# EAGLE board Stimulation_Testbed_Core_V1 (EAGLE 7.5.0)
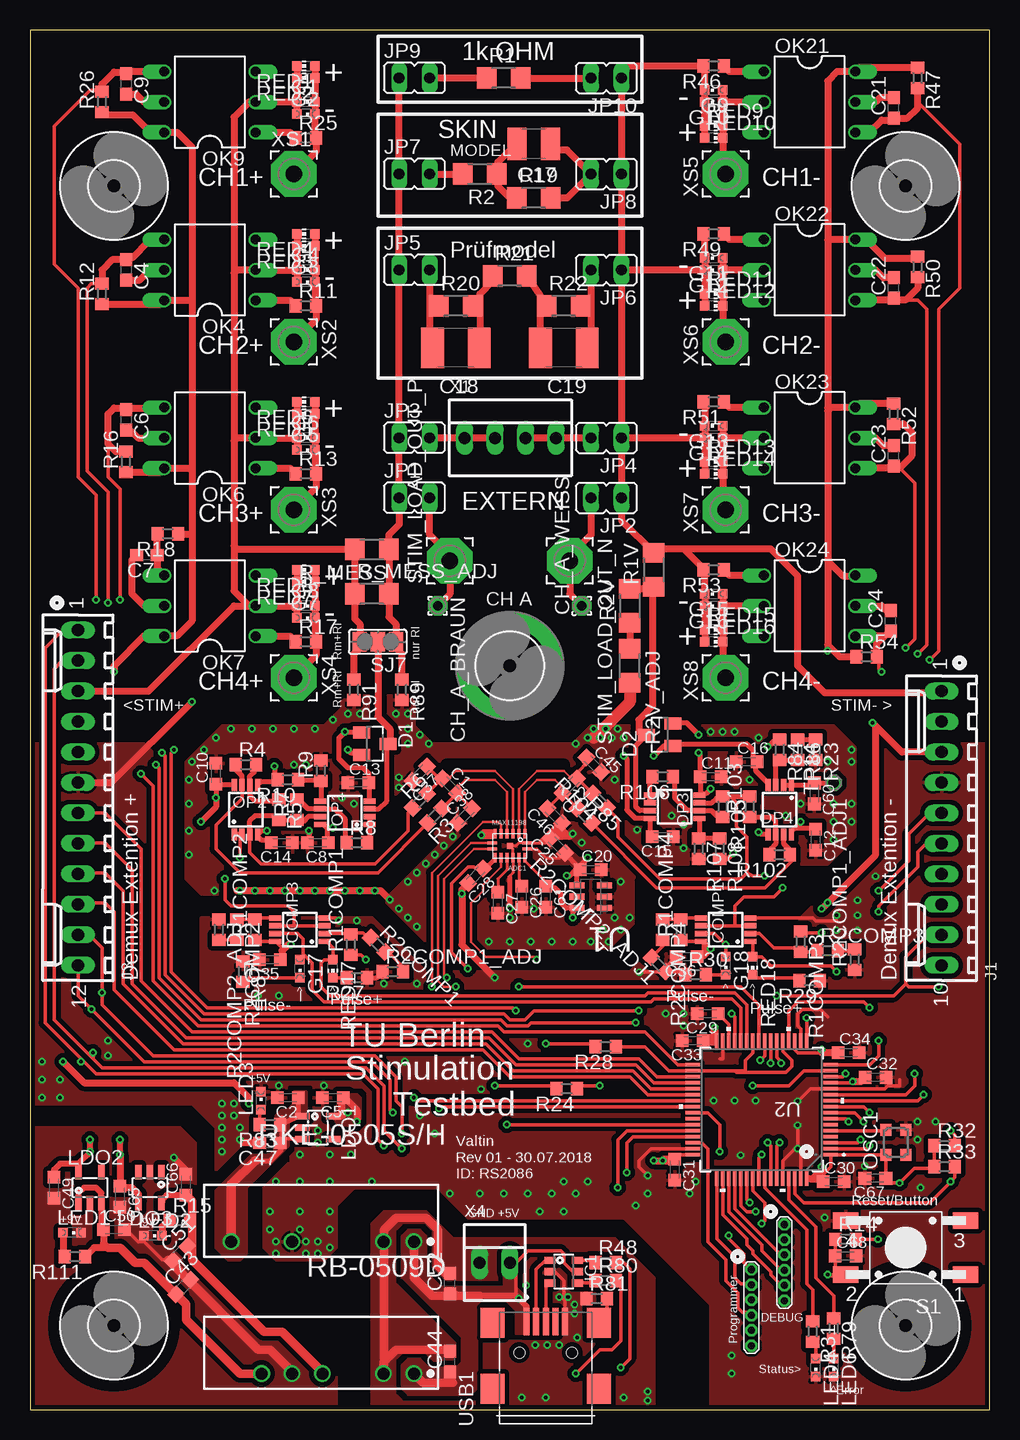
[diagram p3: board, top side]
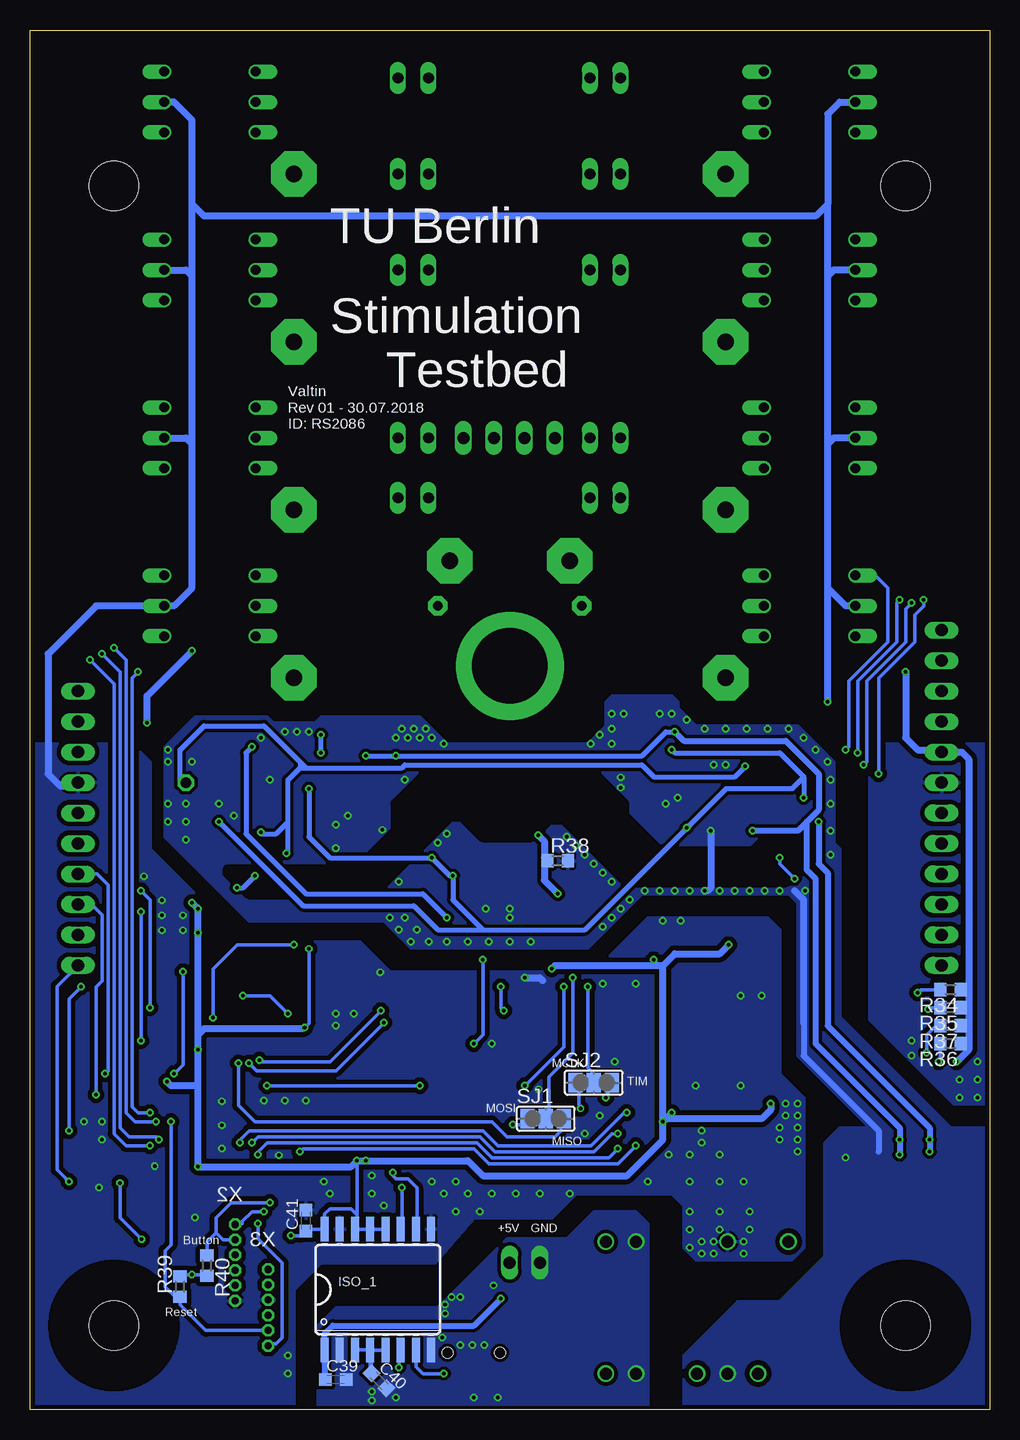
[diagram p4: board, bottom side, seen from below]

Size 80 x 115 mm. Coordinates in mm from the lower left corner, seen from the top.
Outline: 80,0 80,115 0,115 0,0 80,0
Copper layers (1*16): Top 0.035mm / dielectric 1.5mm / Bottom 0.035mm
Design rules "PCB-POOL Standard": minimum track width 0.15mm, minimum drill 0.3mm, track to track 0.15mm, track to pad 0.15mm, pad to pad 0.15mm, via to via 0.15mm, smd to smd 0.15mm, copper to edge 0.3mm, drill to drill 0.2mm, minimum pad ring 0.2mm, minimum via ring 0.15mm, stop-mask expansion 0.075mm, vias tented up to drill 0mil, thermal gap 0.2mm
tRestrict: area 34.8,47.8 to 44.5,53.8; area 29.2,46.8 to 31.5,51.4; area 28.9,43 to 33.6,47.5
bRestrict: area 15,43 to 63.5,53

## Footprints (pad centres in the part's own frame; a part is rotated, then mirrored left to right if it is on the bottom)
T1623CN+1 = smd 0.25 x 0.8: 1 -1.25,-1; 2 -0.75,-1; 3 -0.25,-1; 4 0.25,-1; 5 0.75,-1; 6 1.25,-1; 9 1.25,1; 10 0.75,1; 11 0.25,1; 12 -0.25,1; 13 -0.75,1; 14 -1.25,1 | smd 0.8 x 0.25: 7 1.45,-0.25; 8 1.45,0.25; 15 -1.45,0.25; 16 -1.45,-0.25 | smd 0.5 x 0.5: EXP 0,0
C0603K = smd 1.05 x 1.08: 1 -0.875,0; 2 0.875,0
C0603 = smd 1.1 x 1: 1 -0.85,0; 2 0.85,0
C1210 = smd 1.6 x 2.7: 1 -1.4,0; 2 1.4,0
C1812 = smd 1.9 x 3.4: 1 -1.95,0; 2 1.95,0
1,6/0,8 = drill 0.813 pad 1.6 octagon: 1 0,0
MSOP8 = smd 0.45 x 1: 1 -0.975,-2.05; 2 -0.325,-2.05; 3 0.325,-2.05; 4 0.975,-2.05; 5 0.975,2.05; 6 0.325,2.05; 7 -0.325,2.05; 8 -0.975,2.05
SOT23 = smd 1 x 1.4: 1 -0.95,-1.1; 2 0.95,-1.1; 3 0,1.1
MEJ2 = drill 1 pad 1.18: 1 0,0; 2 2.54,0; 5 10.16,0; 7 15.24,0
NMH = drill 1 pad 1.18: 1 0,0; 2 2.54,0; 4 7.62,0; 5 10.16,0; 6 12.7,0
CHIPLED_0603 = smd 0.8 x 0.8: A 0,-0.75; C 0,0.75
5,5-PAD = drill 6.3 pad 9: B6,3 0,0
SOT-23-6 = smd 0.6 x 0.9: 1 -0.95,-1.15; 2 0,-1.15; 3 0.95,-1.15; 4 0.95,1.15; 5 0,1.15; 6 -0.95,1.15
SOIC16WIDE = smd 0.66 x 2.032: 1 -4.445,-5.029; 2 -3.175,-5.029; 3 -1.905,-5.029; 4 -0.635,-5.029; 5 0.635,-5.029; 6 1.905,-5.029; 7 3.175,-5.029; 8 4.445,-5.029; 9 4.445,5.029; 10 3.175,5.029; 11 1.905,5.029; 12 0.635,5.029; 13 -0.635,5.029; 14 -1.905,5.029; 15 -3.175,5.029; 16 -4.445,5.029
6410-10 = drill 1.016 long: 1 11.43,0; 2 8.89,0; 3 6.35,0; 4 3.81,0; 5 1.27,0; 6 -1.27,0; 7 -3.81,0; 8 -6.35,0; 9 -8.89,0; 10 -11.43,0
6410-12 = drill 1.016 long: 1 13.97,0; 2 11.43,0; 3 8.89,0; 4 6.35,0; 5 3.81,0; 6 1.27,0; 7 -1.27,0; 8 -3.81,0; 9 -6.35,0; 10 -8.89,0; 11 -11.43,0; 12 -13.97,0
JP1 = drill 0.914 long: 1 0,-1.27; 2 0,1.27
SOT-23-5 = smd 0.55 x 1.2: 1 -0.95,-1.3; 2 0,-1.3; 3 0.95,-1.3; 4 0.95,1.3; 5 -0.95,1.3
DIL06 = drill 0.813 offset: 1 -2.54,-3.81; 2 0,-3.81; 3 2.54,-3.81; 4 2.54,3.81; 5 0,3.81; 6 -2.54,3.81
OSC_2.5X2 = smd 1 x 0.9: 1 -1.05,-0.825; 2 1.05,-0.825; 3 1.05,0.825; 4 -1.05,0.825
R1206 = smd 1.6 x 1.803: 1 -1.422,0; 2 1.422,0
R0603 = smd 1 x 1.1: 1 -0.85,0; 2 0.85,0
CHIP-LED0603 = smd 0.8 x 0.8: A 0,-0.75; C 0,0.75
TAST_SMD = smd 2.1 x 1.4: 1 -5,2.25; 2 5,2.25; 3 -5,-2.25; 4 5,-2.25
SJ_2 = smd 1.168 x 1.6: 1 -1.524,0; 2 0,0; 3 1.524,0
3,81/1,4 = drill 1.397 pad 3.81 octagon: 1 0,0
TP1-09 = drill 0.9 pad 1.4 octagon: TP 0,0
SOT95P280X100-6N = smd 1.219 x 0.508: 1 -1.143,0.94; 2 -1.143,0; 3 -1.143,-0.94; 4 1.143,-0.94; 5 1.143,0; 6 1.143,0.94
LQFP64-10X10MM = smd 1.194 x 0.305: 1 -5.75,3.75; 2 -5.75,3.25; 3 -5.75,2.75; 4 -5.75,2.25; 5 -5.75,1.75; 6 -5.75,1.25; 7 -5.75,0.75; 8 -5.75,0.25; 9 -5.75,-0.25; 10 -5.75,-0.75; 11 -5.75,-1.25; 12 -5.75,-1.75; 13 -5.75,-2.25; 14 -5.75,-2.75; 15 -5.75,-3.25; 16 -5.75,-3.75; 33 5.75,-3.75; 34 5.75,-3.25; 35 5.75,-2.75; 36 5.75,-2.25; 37 5.75,-1.75; 38 5.75,-1.25; 39 5.75,-0.75; 40 5.75,-0.25; 41 5.75,0.25; 42 5.75,0.75; 43 5.75,1.25; 44 5.75,1.75; 45 5.75,2.25; 46 5.75,2.75; 47 5.75,3.25; 48 5.75,3.75 | smd 0.305 x 1.194: 17 -3.75,-5.75; 18 -3.25,-5.75; 19 -2.75,-5.75; 20 -2.25,-5.75; 21 -1.75,-5.75; 22 -1.25,-5.75; 23 -0.75,-5.75; 24 -0.25,-5.75; 25 0.25,-5.75; 26 0.75,-5.75; 27 1.25,-5.75; 28 1.75,-5.75; 29 2.25,-5.75; 30 2.75,-5.75; 31 3.25,-5.75; 32 3.75,-5.75; 49 3.75,5.75; 50 3.25,5.75; 51 2.75,5.75; 52 2.25,5.75; 53 1.75,5.75; 54 1.25,5.75; 55 0.75,5.75; 56 0.25,5.75; 57 -0.25,5.75; 58 -0.75,5.75; 59 -1.25,5.75; 60 -1.75,5.75; 61 -2.25,5.75; 62 -2.75,5.75; 63 -3.25,5.75; 64 -3.75,5.75
4,1 = hole 4.1: 0,0
TE_1-1734035-1 = smd 0.5 x 2.3: 1 -1.6,7.85; 2 -0.8,7.85; 3 0,7.85; 4 0.8,7.85; 5 1.6,7.85 | smd 2 x 2.5: 7 4.45,7.75; 8 -4.45,7.75; 9 -4.45,2.25; 10 4.45,2.25 | hole 0.9: -2.2,5.25; 2.2,5.25
22-23-2041 = drill 1 long: 1 -3.81,0; 2 -1.27,0; 3 1.27,0; 4 3.81,0
1.27_1X06_S = drill 0.6 pad 0.813 octagon: P1 0.635,3.175; P2 0.635,1.905; P3 0.635,0.635; P4 0.635,-0.635; P5 0.635,-1.905; P6 0.635,-3.175
22-23-2021 = drill 1 long: 1 -1.27,0; 2 1.27,0

## Placement (x,y rotation side)
ADC1  MAX11198  [T1623CN+1]  40,47 180 top
C1  1nF/25V/C0G/5%  [C0603K]  35,52 315 top
C2  1uF/25V/X7R/10%  [C0603K]  21.5,26 180 top
C4  1nF/25V/X7R/10%  [C0603]  8,95 270 top
C5  1uF/25V/X7R/10%  [C0603K]  25.25,26 180 top
C6  1nF/25V/X7R/10%  [C0603]  8,82.5 270 top
C7  1nF/25V/X7R/10%  [C0603]  9.75,71.25 180 top
C8  100nF/25V/X7R/10%  [C0603K]  24,47.25 180 top
C9  1nF/25V/X7R/10%  [C0603]  8,110.5 270 top
C10  100nF/25V/X7R/10%  [C0603K]  15.5,53 90 top
C11  100nF/25V/X7R/10%  [C0603K]  56.75,52.75 0 top
C12  100nF/25V/X7R/10%  [C0603K]  65.5,47.5 270 top
C13  100nF/25V/X7R/10%  [C0603K]  27.38,52.25 0 top
C14  100nF/25V/X7R/10%  [C0603K]  21,47.25 180 top
C15  100nF/25V/X7R/10%  [C0603K]  52.75,47.75 180 top
C16  100nF/25V/X7R/10%  [C0603K]  59.75,54 0 top
C17  220nF/250V/X7R/10%  [C1210]  42,105.5 180 top
C18  330nF/250V/X7R/10%  [C1812]  35.5,88.5 180 top
C19  330nF/250V/X7R/10%  [C1812]  44.5,88.5 180 top
C20  100nF/25V/X7R/10%  [C0603K]  46.75,45 0 top
C21  1nF/25V/X7R/10%  [C0603]  72,108.5 90 top
C22  1nF/25V/X7R/10%  [C0603]  72,93.5 90 top
C23  1nF/25V/X7R/10%  [C0603]  72,79.5 90 top
C24  1nF/25V/X7R/10%  [C0603]  71.75,65.75 90 top
C25  10uF/25V/X7R/10%  [C0603K]  44,47 135 top
C26  10uF/25V/X7R/10%  [C0603K]  41,42.75 270 top
C27  10uF/25V/X7R/10%  [C0603K]  39,42.25 270 top
C28  10uF/25V/X7R/10%  [C0603K]  37.15,44.5 225 top
C29  4.7uF/25V/X7R/10%  [C0603K]  56.5,33 180 top
C30  4.7uF/25V/X7R/10%  [C0603K]  67,19 0 top
C31  4.7uF/25V/X7R/10%  [C0603K]  53.75,20 270 top
C32  4.7uF/25V/X7R/10%  [C0603K]  70.5,27.7 0 top
C33  4.7uF/25V/X7R/10%  [C0603K]  55.25,30.75 180 top
C34  4.7uF/25V/X7R/10%  [C0603K]  68.25,29.75 0 top
C35  100nF/25V/X7R/10%  [C0603K]  20,37.5 180 top
C36  100nF/25V/X7R/10%  [C0603K]  54.75,37.75 180 top
C37  0.1nF/25V/C0G/5%  [C0603K]  32.5,53 225 top
C38  0.1nF/25V/C0G/5%  [C0603K]  36.25,49.5 45 top
C39  100nF/25V/X7R/10%  [C0603K]  54.5,2.5 0 bottom
C40  100nF/25V/X7R/10%  [C0603K]  50.9,2.4 315 bottom
C41  100nF/25V/X7R/10%  [C0603K]  57,15.75 90 bottom
C42  1nF/25V/C0G/5%  [C0603K]  45,52 225 top
C43  4.7u/25V/X7R  [C0603]  12.77,10.2 45 top
C44  4.7u/15V/X7R  [C0603]  35,4 90 top
C45  0.1nF/25V/C0G/5%  [C0603K]  47,53.75 315 top
C46  0.1nF/25V/C0G/5%  [C0603K]  43.75,49.5 135 top
C47  4.7u/25V/X7R  [C0603]  20,22.25 180 top
C49  1uF/25V/X7R/10%  [C0603K]  2,18.5 270 top
C50  1uF/25V/X7R/10%  [C0603K]  7,15 0 top
C51  4.7u/25V/X7R  [C0603]  12.5,13 45 top
C52  4.7u/25V/X7R  [C0603]  35,10.5 90 top
C60  1uF/25V/X7R/10%  [C0603K]  65.39,51.36 270 top
C61  1uF/25V/X7R/10%  [C0603K]  43,42.75 270 top
C65  4.7uF/25V/X7R/10%  [C0603K]  7.5,17.75 270 top
C66  1uF/25V/X7R/10%  [C0603K]  13,18.75 90 top
C67  100nF/25V/X7R/10%  [C0603K]  70.48,19.28 180 top
C68  100nF/25V/X7R/10%  [C0603K]  68,12.8 0 top
CH_A_BRAUN  [1,6/0,8]  34,67 270 top
CH_A_WEISS  [1,6/0,8]  46,67 90 top
COMP1  TS3022IST  [MSOP8]  58,40 90 top
COMP3  TS3022IST  [MSOP8]  22.5,40 90 top
D1  BAS70-04  [SOT23]  28.75,55.5 270 top
D2  BAS70-04  [SOT23]  52.5,56.25 90 top
DC-DC_3V3  RKE-0505S/H  [MEJ2]  32,14 180 top
DC-DC_9V  RB-0509D  [NMH]  32,3 180 top
G1  150060VS75000  [CHIPLED_0603]  23,109 270 top
G2  150060VS75000  [CHIPLED_0603]  23,108 270 top
G3  150060VS75000  [CHIPLED_0603]  23,94 270 top
G4  150060VS75000  [CHIPLED_0603]  23,95 270 top
G5  150060VS75000  [CHIPLED_0603]  23,80 270 top
G6  150060VS75000  [CHIPLED_0603]  23,81 270 top
G7  150060VS75000  [CHIPLED_0603]  23,66 270 top
G8  150060VS75000  [CHIPLED_0603]  23,67 270 top
G9  150060VS75000  [CHIPLED_0603]  57,110 90 top
G10  150060VS75000  [CHIPLED_0603]  57,109 90 top
G11  150060VS75000  [CHIPLED_0603]  57,96 90 top
G12  150060VS75000  [CHIPLED_0603]  57,95 90 top
G13  150060VS75000  [CHIPLED_0603]  57,82 90 top
G14  150060VS75000  [CHIPLED_0603]  57,81 90 top
G15  150060VS75000  [CHIPLED_0603]  57,68 90 top
G16  150060VS75000  [CHIPLED_0603]  57,67 90 top
G17  150060VS75000  [CHIPLED_0603]  22.5,36.75 180 top
G18  150060VS75000  [CHIPLED_0603]  58,37 180 top
H1  BINDER_STIM  [5,5-PAD]  40,62 270 top
IC1  USBLC6-2  [SOT-23-6]  44.5,11.5 270 top
ISO_1  ADUM4160  [SOIC16WIDE]  51,10 0 bottom
J1  22-27-2101-10  [6410-10]  76,48.45 90 top
J3  22-27-2121-12  [6410-12]  4,51 90 top
JP1  [JP1]  32.05,76 270 top
JP2  [JP1]  48.05,76 90 top
JP3  [JP1]  32.05,81 270 top
JP4  [JP1]  48.05,81 90 top
JP5  [JP1]  32.05,95 270 top
JP6  [JP1]  48.05,95 90 top
JP7  [JP1]  32.05,103 270 top
JP8  [JP1]  48.05,103 90 top
JP9  [JP1]  32.05,111 270 top
JP10  [JP1]  48.05,111 90 top
LDO1  LDK220U33R ->3.3V  [SOT-23-5]  24,23.5 270 top
LDO2  LDK220M50R ->5V  [SOT-23-5]  5,18.5 0 top
LDO3  MIC5270-5.0YM5  [SOT-23-5]  10,18.5 180 top
LED1  [CHIPLED_0603]  3.5,14.75 270 top
LED2  [CHIPLED_0603]  10.25,14.5 270 top
LED3  [CHIPLED_0603]  19.25,25.75 0 top
LED4  Red  [CHIPLED_0603]  65.5,3.5 180 top
LED6  Red  [CHIPLED_0603]  67,3.5 180 top
OK4  H11L1M  [DIL06]  15,95 90 top
OK6  H11L1M  [DIL06]  15,81 90 top
OK7  H11L1M  [DIL06]  15,67 90 top
OK9  H11L1M  [DIL06]  15,109 90 top
OK21  H11L1M  [DIL06]  65,109 270 top
OK22  H11L1M  [DIL06]  65,95 270 top
OK23  H11L1M  [DIL06]  65,81 270 top
OK24  H11L1M  [DIL06]  65,67 270 top
OP1  LT1819CMS8#PBF  [MSOP8]  26.25,49.75 90 top
OP2  LT1819CMS8#PBF  [MSOP8]  18,50 0 top
OP3  LT1819CMS8#PBF  [MSOP8]  53.75,50.25 270 top
OP4  LT1819CMS8#PBF  [MSOP8]  62.5,50 180 top
OSC1  DSC6011JI2A-008.0000 / X1G004171001512  [OSC_2.5X2]  72.18,22.27 90 top
R1  1k  [R1206]  39.5,111 0 top
R1COMP1  7k  [R0603]  26.75,38.75 90 top
R1COMP2  7k  [R0603]  18.75,40 90 top
R1COMP3  7k  [R0603]  64.25,39 270 top
R1COMP4  7k  [R0603]  54.25,40 90 top
R1V  1M49  [R1206]  52,70 90 top
R2  470R  [R1206]  37.5,103 180 top
R2COMP1  5k  [R0603]  29,38.75 315 top
R2COMP1_ADJ  [R0603]  30.25,36.5 0 top
R2COMP1_ADJ1  [R0603]  68.75,37.5 90 top
R2COMP2  5k  [R0603]  17.25,40 270 top
R2COMP2_ADJ  1k  [R0603]  15.75,40 270 top
R2COMP2_ADJ1  1k  [R0603]  52.4,37.1 135 top
R2COMP3  5k  [R0603]  66.5,38.25 0 top
R2COMP4  5k  [R0603]  52.75,40 270 top
R2V  10k  [R1206]  50,67 90 top
R2V_ADJ  0  [R1206]  50,62 270 top
R3  11R  [R0603]  33.75,49.5 225 top
R4  1k  [R0603]  18,53.75 0 top
R5  1k  [R0603]  20.75,50 270 top
R6  11R  [R0603]  32.5,50.75 45 top
R7  1k  [R0603]  22.25,50 90 top
R8  1k  [R0603]  27.25,47.25 0 top
R9  1k  [R0603]  24.25,53.25 90 top
R10  1k  [R0603]  21.5,52.5 180 top
R11  51  [R0603]  23,92 0 top
R12  100k  [R0603]  6,93 90 top
R13  51  [R0603]  23,78 0 top
R14  100k/1%  [R0603]  68,14.2 0 top
R15  2k/1%  [R0603]  12.5,15.75 0 top
R16  100k  [R0603]  8,79 90 top
R17  51  [R0603]  23,64 0 top
R18  100k  [R0603]  11.5,73 180 top
R19  2k7  [R1206]  42,101 0 top
R20  1k8  [R1206]  35.5,92 0 top
R21  1k  [R1206]  40,94.5 0 top
R22  1k8  [R1206]  44.5,92 0 top
R23  0R  [R0603]  65.5,55 270 top
R24  0R  [R0603]  44.75,26.75 180 top
R25  51  [R0603]  23,106 0 top
R26  100k  [R0603]  6,109 90 top
R27  1k/1%  [R0603]  27.25,36 180 top
R28  0R  [R0603]  48,30.25 180 top
R29  1k/1%  [R0603]  65,35.75 180 top
R30  1k/1%  [R0603]  55.5,36.25 0 top
R31  2k/1%  [R0603]  65.25,6.5 270 top
R32  4k7/1%  [R0603]  76.25,22 0 top
R33  4k7/1%  [R0603]  76.25,20.25 0 top
R34  4k7/1%  [R0603]  3.25,35 180 bottom
R35  4k7/1%  [R0603]  3.25,33.5 180 bottom
R36  4k7/1%  [R0603]  3.25,30.5 180 bottom
R37  4k7/1%  [R0603]  3.25,32 180 bottom
R38  NA/0R/1%  [R0603]  36,45.75 0 bottom
R39  0/1%  [R0603]  67.5,10.25 90 bottom
R40  0/1%  [R0603]  65.25,12 270 bottom
R46  51  [R0603]  57,112 180 top
R47  100k  [R0603]  74,111 270 top
R48  24/1%  [R0603]  48,12.25 0 top
R49  51  [R0603]  57,98 180 top
R50  100k  [R0603]  74,95.25 270 top
R51  51  [R0603]  57,84 180 top
R52  100k  [R0603]  72,83 270 top
R53  51  [R0603]  57,70 180 top
R54  100k  [R0603]  69.75,62.75 0 top
R79  2k/1%  [R0603]  67,6.75 270 top
R80  24/1%  [R0603]  48,10.75 0 top
R81  10/5%  [R0603]  47.25,9.25 0 top
R83  1k/1%  [R0603]  20,23.75 180 top
R84  100k  [R0603]  62.5,55 270 top
R85  11R  [R0603]  46.25,49.5 315 top
R86  100k  [R0603]  64,55 270 top
R87  1k/1%  [R0603]  17.75,36.5 270 top
R89  0R or NA  [R0603]  31,60 270 top
R91  NA or 0R  [R0603]  27,60 270 top
R102  1k  [R0603]  62.5,46.25 180 top
R103  1k  [R0603]  60,50.25 90 top
R104  11R  [R0603]  47.5,50.75 135 top
R105  1k  [R0603]  57.75,50.25 270 top
R106  1k  [R0603]  52.75,52.75 180 top
R107  1k  [R0603]  55.75,46.75 270 top
R108  1k  [R0603]  57.5,46.75 270 top
R111  2k/1%  [R0603]  3.75,12.75 180 top
R_MESS  6R7  [R1206]  28.5,71.7 180 top
R_MESS_ADJ  [R1206]  28.5,68 0 top
RED1  150060RS75000  [CHIP-LED0603]  23,112 90 top
RED2  150060RS75000  [CHIP-LED0603]  23,111 90 top
RED3  150060RS75000  [CHIP-LED0603]  23,97 90 top
RED4  150060RS75000  [CHIP-LED0603]  23,98 90 top
RED5  150060RS75000  [CHIP-LED0603]  23,83 90 top
RED6  150060RS75000  [CHIP-LED0603]  23,84 90 top
RED7  150060RS75000  [CHIP-LED0603]  23,69 90 top
RED8  150060RS75000  [CHIP-LED0603]  23,70 90 top
RED9  150060RS75000  [CHIP-LED0603]  57,107 270 top
RED10  150060RS75000  [CHIP-LED0603]  57,106 270 top
RED11  150060RS75000  [CHIP-LED0603]  57,93 270 top
RED12  150060RS75000  [CHIP-LED0603]  57,92 270 top
RED13  150060RS75000  [CHIP-LED0603]  57,79 270 top
RED14  150060RS75000  [CHIP-LED0603]  57,78 270 top
RED15  150060RS75000  [CHIP-LED0603]  57,65 270 top
RED16  150060RS75000  [CHIP-LED0603]  57,64 270 top
RED17  150060RS75000  [CHIP-LED0603]  25.25,36.75 180 top
RED18  150060RS75000  [CHIP-LED0603]  60.25,37 180 top
S1  [TAST_SMD]  73,13.5 180 top
SJ1  [SJ_2]  37,24.25 0 bottom
SJ2  [SJ_2]  33,27.25 0 bottom
SJ7  [SJ_2]  29,64 180 top
STIM_LOAD_OUT_N  [3,81/1,4]  45,70.75 270 top
STIM_LOAD_OUT_P  [3,81/1,4]  35,70.75 90 top
TP14  TESTPOINT_TH  [TP1-09]  67,52.25 90 top
U1  LT1790BCS6-2.5#TRMPBF  [SOT95P280X100-6N]  46.75,42.75 180 top
U2  STM32F412R  [LQFP64-10X10MM]  61,25 180 top
U$1  [4,1]  73,7 0 top
U$2  [4,1]  7,7 0 top
U$3  [4,1]  7,102 0 top
U$4  [4,1]  73,102 0 top
USB1  1-1734035-1  [TE_1-1734035-1]  43,-0.5 0 top
X1  22-23-2041  [22-23-2041]  40.05,81 0 top
X2  PINHD-1X66X1.27  [1.27_1X06_S]  62.25,12.25 0 top
X3  PINHD-1X66X1.27  [1.27_1X06_S]  59.5,8.5 0 top
X4  22-23-2021  [22-23-2021]  38.75,12.25 0 top
XS1  WIREPAD3,81/1,4  [3,81/1,4]  22,103 0 top
XS2  WIREPAD3,81/1,4  [3,81/1,4]  22,89 270 top
XS3  WIREPAD3,81/1,4  [3,81/1,4]  22,75 270 top
XS4  WIREPAD3,81/1,4  [3,81/1,4]  22,61 270 top
XS5  WIREPAD3,81/1,4  [3,81/1,4]  58,103 90 top
XS6  WIREPAD3,81/1,4  [3,81/1,4]  58,89 90 top
XS7  WIREPAD3,81/1,4  [3,81/1,4]  58,75 90 top
XS8  WIREPAD3,81/1,4  [3,81/1,4]  58,61 90 top

## Tracks (layer width: path | path; a pad name or v marks a point on that pad's centre or on a via)
2XVREF
  Top 0.4: OP3.2 OP3.1 51.7,52.55 R106.2
2XVREF1
  Top 0.4: OP1.2 OP1.1 28.3,47.45 R8.2
+3V3  (via drill 0.3)
  Top 0.2: ADC1.9 38.75,45.75 38.25,45.25 38,45.25 37.75,45.25 C28.1 37.76,45.13
  Top 0.3: R1COMP2.1 18.88,39.02 COMP3.8 20.48,39.02 21,38.5 21,38.25 | 21,37.62 C35.1 | R1COMP4.1 54.38,39.02 COMP1.8 56.23,39.02 | 56.23,39.02 56.75,38.5 v56.75,38.4 | v36.5,36.75 35.12,38.12 35.12,43.88 36.5,45.25 37,45.25 37.12,45.13 37.76,45.13 | 38,45.25 38.62,45.88 | U2.48 54.12,21.25 C31.1 | 65,19.25 65.88,19.25 C30.1 66,19.12 66,19.25 66,19.5 66.75,20.25 U2.1 71.33,21.25 OSC1.4 71.36,19.04 C67.1 71.5,18.89 v72.5,18.89 73.72,20.1 75.25,20.1 R33.1 R32.1 | U2.19 63.75,30 64,29.75 66,29.75 | v70.7,14.2 R14.2 | X3.P1 59.63,12.12 | 59.63,12.12 59.75,12 | 59.63,12.12 59.5,12.25 59.5,13 58.25,14.25 v58.25,14.5 | U2.64 65,19.25 | 65,19.25 v66,20.25 | U2.32 57.25,31.75 v57.1,31.85 57,31.75 | U2.32 57.25,30.5 56.38,30.5 C33.1 | U2.32 56.25,30.75 | R1COMP1.1 27.6,37.9 v28,37.5 | U2.13 68.5,27.25 v68.6,27.35 | 56.23,39.02 56.23,38.52 56.25,38.5 | R1COMP3.1 64.35,39.75 v66,39.75
  Top 0.5: 52.88,20.88 v52.75,20.75 | v26.5,24.75 26.25,24.75 | 26,25.88 C5.1 | 25.95,24.45 26,24.5 | C36.1 56.1,37.75 v56.75,38.4 | 56.25,38 56.25,38.5 56.25,38.75
  Top 0.6: 13.5,92.5 13.5,105.25 12.29,106.46 OK9.6 10.9,106.75 9.75,106.75 8.6,107.9 6.25,107.9 R26.1 | 13.5,92.5 13.5,78.25 | 13.5,78.25 13.5,73 | 13.5,73 13.5,65.75 12.25,64.5 11.23,64.5 OK7.6 9.46,64.46 | 13.5,78.25 13.29,78.46 OK6.6 10.88,78.15 R16.1 | 13.5,92.5 13.46,92.46 OK4.6 10.88,92.15 R12.1 | R18.1 13.5,73 | 66.5,97.5 66.5,110.75 67.29,111.54 OK21.6 69.12,111.85 R47.1 | 66.5,97.5 66.5,83.5 | 66.5,83.5 66.5,83.25 | 66.5,83.25 66.5,70.75 | 66.5,70.75 67.75,69.5 68.77,69.5 OK24.6 | 66.5,70.75 66.5,63.75 | 66.5,63.75 v66.5,63.25 | 66.54,83.54 66.5,83.5 | R52.1 69.12,83.85 OK23.6 66.79,83.54 66.5,83.25 | 66.5,97.5 66.54,97.54 OK22.6 69.71,97.54 71.25,96 73.9,96 R50.1 | 21,37.62 21,38.25 21.5,38.75 v21.75,38.75 | 9.46,64.46 9.5,64.5 | 9.46,64.46 7,62 v7,61.5 | J1.3 72.69,54.8 70.5,57 | R54.1 67.5,62.75 66.5,63.75 | C31.1 52.88,20.88 | 26.25,24.75 26,24.5 26,25.88 | LDO1.5 25.95,24.45 | v52,20.75 v52.75,20.75 53.5,20.75 | v66,41.75 70.5,46.25 70.5,57 | 70.5,57 v70.25,57.25 | 66,29.75 C34.1 66.25,29.75 v66,30 | 57,31.75 57,31 56.75,31 | C5.1 26.25,26 27.25,25 v27.25,24 | v2.75,29 4.5,27.25 17,27.25 18.25,26 v18.25,25.5 | v68.6,27.35 69.28,27.35 C32.1 | v66,20.25 66,19.25 | 66,19.25 66,19 | 66,19.25 65.75,19.25 | 65,19.25 65.75,19.25 | 65.75,19.25 65.75,19.5
  Bottom 0.3: v72.5,18.89 72.5,16 v70.7,14.2 70.75,14.15 | v58.25,14.5 57.25,14.5 57,14.75 57.12,14.75 C41.1 56.85,15.03 ISO_1.16 55.45,16.3 55,16.75 53.25,16.75 52.75,16.25 | 52.75,16.25 52.75,15.18 ISO_1.14 ISO_1.13 ISO_1.12 | 52.75,16.25 v52.75,20.75 | v56.75,38.4 56.75,32.2 v57.1,31.85 | v28,37.5 27.5,37 | R34.1 1.75,35 1.75,34.75 | R35.1 1.75,33.5 1.75,33.25 | R37.1 1.75,32 | R36.1 1.75,30.5
  Bottom 0.6: v7,61.5 7,56 6,55 4.19,55 J3.5 2.31,54.81 1.75,54.25 1.75,34.75 1.75,33.25 1.75,32 1.75,30.5 1.75,30 v2.75,29 | v70.25,57.25 70.25,59.5 v66.5,63.25 | v27.25,24 27.25,22.5 30.25,19.5 42.25,19.5 43.5,20.75 v52.75,20.75 53.25,20.25 v66,20.25 66,27 | v27.25,24 v26.5,24.75 | 66,27 v66,30 66,31.25 | 66,31.25 v66,39.75 v66,41.75 v66.5,42.25 | v57.1,31.85 57.25,31.75 65.5,31.75 66,31.25 | v27.25,24 27.25,37 | 27.25,37 26.25,38 22.5,38 v21.75,38.75 | 27.25,37 27.5,37 36.25,37 v36.5,36.75 | v18.25,25.5 18.25,25 19,24.25 27,24.25 v27.25,24 | 66,27 68.25,27 v68.6,27.35
  pour Top (isolate 0.4, no thermals): 25.5,24 25.5,25.25 26.75,26.25 27.25,26.25 27.5,26 27.5,24.25 27,23.75 25.75,23.75
+5V  (via drill 0.3)
  Top 0.25: ADC1.15 42.25,46.75 43,46 44.24,46 C25.1
  Top 0.4: 55.88,51.38 C11.1 55.88,54.62 v55.75,54.75 | OP3.8 55.88,51.3 55.88,51.38 | OP4.8 63.48,48.23 63.75,48.5 | 63.75,48.5 65.38,48.5 C12.1 | OP1.8 24.48,48.77 24.75,48.5 | 24.75,48.5 24.75,47.38 C8.1 | OP2.8 16.95,52.12 C10.1 v15.5,51 | 63.75,48.5 v64.25,49 | v25.25,48.5 24.75,48.5 | v55.75,56.25 54.75,57.25 53.65,57.25 D2.2 | 55.88,51.38 56.38,51.38 v56.75,51.75 | 45.61,44.73 45.61,45.11 | 45.62,45.12 45.75,45.25 | 45.75,45.25 v46.5,46 | U1.4 45.61,44.73 | 45.61,44.73 C20.1 45.88,45.12 45.62,45.12 | 45.62,45.12 45.61,45.11 | v44.75,44.5 45,44.5 45.61,45.11 | 45.75,45.25 | 45.75,45.25 C25.1 | v26.5,55 26.75,54.75 27.45,54.75 D1.2
  Top 0.5: C49.1 2,20 2.5,20.5 4,20.5 4.05,20.45 LDO2.5 4.05,20.55 v5,21.5 v5,22.5 | v15.5,51 15.5,50.25 v14.25,49
  Bottom 0.4: v64.25,49 57.25,42 48,42 46,40 42.25,40 | 42.25,40 33.75,40 v25.25,48.5 22,51.75 16.5,51.75 15.5,52.75 | 42.25,40 44.75,42.5 v44.75,44.5 45,44.5 v46.5,46 55,46 56.75,47.75 v56.75,51.75 | v55.75,54.75 v55.75,56.25 | v26.5,55 26.25,54.75 17.5,54.75 15.5,52.75 | 15.5,52.75 v15.5,51
  Bottom 0.5: v14.25,49 14.25,45.5 13.5,44.75 13.5,32 5,23.5 v5,21.5
  pour Top (isolate 0.2, no thermals): 41.75,46.75 42,46.5 42,46 42.5,45.5 45,45.5 45.5,45 46.25,45.75 46.25,46 45.75,46 44.75,47 44,46.25 42.75,46.25 42.25,46.75
+5V_IN
  Top 0.3: LDO1.3 20.9,22.55
  Top 0.4: 22.65,24.5 LDO1.1 | 18.75,20.75 20,20.75 21,21.75 21,22.35 C47.1 | 20.9,22.55 C47.1 | C47.1 21,22.65 21,24.35 R83.1 22.5,24.5 22.38,24.62 C2.1
  Top 0.8: DC-DC_3V3.7 16.76,18.76 18.75,20.75
  pour Top (isolate 0.4, no thermals): 21,25 21.5,25 22,25.5 22,26.5 23,26.5 23,24.5 22,24.5 21.5,24 21.5,22 18,18.5 18,13 17.5,12.5 16.5,12.5 15.5,13.5 15.5,18.25 18.5,21.25 20,21.25 20.5,21.75 20.5,24.5
+5V_USB  (via drill 0.3)
  Top 0.3: 40.5,9.5 40.5,12.25 41.5,13.25 44.25,13.25 44.5,13 44.5,12.25 45.25,11.5 IC1.5
  Top 0.5: USB1.1 41.4,8.6 v40.75,9.25 40.5,9.5 37.75,9.5
  Top 0.7: DC-DC_9V.1 32.75,2.25 35.25,2.25 35,2.5 C44.1 | DC-DC_3V3.1 32,11 33.5,9.5 34.85,9.5 C52.1 35.35,9.65 35.5,9.5 37.5,9.5
  Bottom 0.5: C39.1 55.45,2.57 ISO_1.1 55.45,6.3 54.75,7 43,7 v40.75,9.25
  pour Top (isolate 0.3, no thermals): 41.25,6.3 40.5,6.3 40.5,8.25 39.5,9.25 37.75,9.25 37.25,8.75 37.25,1.75 36.75,1.25 31.5,1.25 31,1.75 31,3.75 31.5,4.25 32.5,4.25 33.25,3.5 35.5,3.5 36,4 36,6 31,11 31,14.5 31.5,15 32.5,15 33,14.5 33,11.5 34.25,10.25 39.5,10.25 39.5,11.25 40.5,11.25 40.5,10.25 41.25,9.5
+9V
  Top 0.3: C43.1 12.4,9.6
  Top 0.5: C50.1 5.95,15.68 LDO2.3 5.95,18.05 5.5,18.5 4.5,18.5 4.05,18.05 LDO2.1
  Top 0.6: C50.1 6.12,13.88 6.5,13.5 5.35,13.5 R111.1
  Top 0.7: DC-DC_9V.6 17.5,3 13,7.5 13,8.77 C43.1 12.02,9.75 12,9.75 9.5,12.25 8.75,12.25 7.5,13.5 6.5,13.5
-5V  (via drill 0.3)
  Top 0.4: C15.2 51.7,47.92 OP3.4 50.48,49.27 49.75,50 49.75,54.25 v49.5,54.5 | OP4.4 61.52,52.23 60.5,53.25 60.5,54.12 C16.2 60.25,54.38 60.25,55 59.75,55.5 54.25,55.5 54.05,55.3 D2.1 52.8,55.3 v52,54.5 | OP1.4 28.3,52.2 C13.2 28.25,53 27.75,53.5 26.5,53.5 25.75,54.25 25.75,56 v26.25,56.5 27.6,56.5 D1.1 | C14.2 19.88,47.5 19.25,47.5 18.98,47.77 OP2.4 19.27,48.25 v19.75,48.25
  Top 0.5: LDO3.4 9.05,17.45 | v7.5,21.25 v7.5,22.5
  Top 0.6: 9.05,17.45 9.05,17.95 8.5,18.5 7.62,18.5 C65.1 v7.5,21.25
  Bottom 0.4: v52,54.5 v49.5,54.5 29,54.5 27,56.5 v26.25,56.5
  Bottom 0.5: v26.25,56.5 25.5,55.75 17,55.75 14.25,53 14.25,50 15.25,49 | 15.25,49 16,48.25 v19.75,48.25 | 15.25,49 15.25,45 14.5,44.25 14.5,30.5 7.5,23.5 v7.5,21.25
-9V
  Top 0.5: C66.1 11.38,17.88 11,17.5 11,17.25 LDO3.5
  Top 0.6: R15.2 13.35,15.85 13.5,16
  Top 0.7: DC-DC_9V.4 24.38,3.12 21,6.5 19.5,6.5 13.5,12.5 13.5,13 | 13.5,13 13.5,16 13.5,17.38 C66.1 | C51.2 13.1,13.4 13.5,13
ADC_CONVERSION  (via drill 0.3)
  Top 0.2: ADC1.5 39.25,48.75 39,49 37.75,49 33.5,44.75 v33.5,35.25
  Bottom 0.3: v33.5,35.25 33.5,28.5 33,28 SJ2.2
ADC_SCK  (via drill 0.3)
  Top 0.2: ADC1.10 39.25,45.25 37.75,43.75 37.75,43.25 36.75,42.25 36.75,39 38,37.75 42,37.75 v42.25,37.5
  Top 0.3: v43,30.5 47,30.5 46.9,30.4 46.9,30 R28.2
  Bottom 0.3: v42.25,37.5 42.25,31.25 v43,30.5
ADC_SDO_I  (via drill 0.3)
  Top 0.2: ADC1.7 36.75,47.25 34,44.5 34,35.75 34.5,35.25 v35.5,35.25
  Top 0.3: v38.75,27 43.75,27 43.9,26.85 R24.2
  Bottom 0.3: v35.5,35.25 35.5,30.25 v38.75,27
ADC_SDO_V  (via drill 0.3)
  Top 0.2: ADC1.8 37,46.75 34.5,44.25 34.5,36.25 v34.75,36
  Bottom 0.3: v34.75,36 34.75,29.75 36.75,27.75 36.75,24.5 SJ1.2
AGND  (via drill 0.3)
  Top 0.25: C25.2 43.01,47.25 ADC1.16 40.75,47.25 40.5,47 ADC1.EXP 40.25,46.75 ADC1.12 40.25,44.75 40,44.5 40,44.38
  Top 0.3: 11.5,12.5 11,12.5 9.5,14 9,14 8,15
  Top 0.4: v23.25,48.25 23.25,47.38 C8.2 | 40,42.12 40,44.38 | 42.62,47.38 44,48.75 45,47.75 | 44,47.75 44,48
  Top 0.5: 2,17.5 C49.2 | v12,21 13,20 C66.2 | 45,47.75 44,47.75
  Top 0.6: v30,42.5 29.25,43.25 17.25,43.25
  Top 0.7: DC-DC_9V.5 21.84,3.16 20,5 19,5 11.6,12.4 | 11.6,12.4 11.5,12.5 | C51.1 11.6,12.4
  Top 0.8: 44,48 44.25,48.25
  Top 1: R2V_ADJ.2 50,59 47,56
  Bottom 0.5: 15.5,32.25 15.5,29.5 9.25,23.25 9.25,21.5
  Bottom 0.6: v23.25,48.25 23.25,43.5 23.5,43.25 | 15.5,32.25 15.5,42.5 16.25,43.25
  other vias: 13.25,50.5 26.5,58 27.5,58 30.5,58 31.5,58 31.5,56.75 32.5,56.25 22,53.75 23,53.75 30.75,51.85 31.5,44 35.25,47.75 45.25,48 46,47.25 49.25,44 54.5,46.8 50.62,48.33 54.5,48.75 53.5,49.5 48.75,52.5 49.5,56 48.5,56 47.5,56 56.75,56.5 58.75,56.5 60,52.5 66.5,54 67,50.5 67,49 67,47.5 68.5,49 68.5,50.5 68.5,54 13.5,54 14.5,55 15.5,56 27,50.5 26,51 40,41 42,41.75 40,41.75 48.75,41 47.75,40 60.75,56 63,49.5 64.25,50.5 57.75,56.5 68.5,55 13.25,52.5 13.25,48.25 30.75,52.7 16.75,56.75 18.5,56.75 20.25,56.75 22,56.75 23.75,56.75 25.25,57.5 31.5,55.5 33.25,55.5 30.75,41.75 31.5,41 32.25,40.25 32.25,44.75 33,45.5 33.75,46.25 34.5,47 46.5,56 47,56.75 48,56.75 49,56.75 45.5,55.5 13.25,46.25 38.25,39 40,39 41.75,39 43.5,39 45.25,39 46.75,39 49.25,40 50,41 28.75,43.25 27.5,43.25 26.25,43.25 25,43.25 23.75,43.25 22.5,43.25 21.25,43.25 20,43.25 18.75,43.25 17.5,43.25 15.38,43.25 48.25,39
  pour Bottom (isolate 0.4, no thermals): 25.5,0 25.5,4.5 21,9 17.5,9 13.75,12.75 13.75,22.25 12.5,23.5 0,23.5 0,0
  pour Top (isolate 0.4, no thermals): 25.5,0 25.5,4.5 21,9 17.5,9 13.75,12.75 13.75,22.25 12.5,23.5 0,23.5 0,0
  pour Top (isolate 0.4, rank 2): 16,57 13,54 13,44.25 14.25,43 16,43 16,46.5 27.5,46.5 29.75,44.25 29.75,42.25 33.5,38.5 48.25,38.5 50.25,40.5 50.25,44.25 51.5,45.5 66.5,45.5 68.75,47.75 68.75,55.25 67,57 46.75,57 45.25,55.5 33.5,55.5 32,57 32,59 31.5,59.5 26.5,59.5 26,59 26,58.5 24.5,57
  pour Bottom (isolate 0.3): 16,57 13,54 13,46.25 16.25,43 29,43 33.5,38.5 48.25,38.5 50.5,40.75 61.75,40.75 68.75,47.75 68.75,55.25 66.25,57.75 60.25,57.75 59.75,57.25 56.25,57.25 55.75,57.75 47.5,57.75 45.25,55.5 33.5,55.5 32,57 32,59 31.5,59.5 26.5,59.5 26,59 26,58.5 24.5,57
  pour Bottom (isolate 0.3): 17,43.25 16,42.25 16,29.5 9.5,23 9.5,19.25 1.5,19.75 1.5,21.75 12.5,32.75 12.5,46.75 13.25,47.5 16,47.5 16,44 16.25,44
AIN1+
  Top 0.2: ADC1.4 39.75,51.5 38.75,52.5 36.25,52.5 35.75,52 35.75,51.51 C1.2
  Top 0.3: C1.2 R3.1 | C1.2 | C1.2 C38.2
AIN1-
  Top 0.2: ADC1.3 40.25,51.75 38.75,53.25 35.5,53.25 35,52.75 34.51,52.75 C1.1
  Top 0.3: R6.2 C1.1 34.12,52.62 C37.1
AIN2+
  Top 0.2: 45.13,52.62 44.5,53.25 42.25,53.25 40.75,51.75 ADC1.2
  Top 0.3: C42.1 R104.2 | 45.13,52.62 C42.1 45.75,52.75 45.75,53.25 46.38,53.88 C45.1
  Top 0.4: C42.1
AIN2-
  Top 0.2: ADC1.1 41.25,51.5 42.25,52.5 43.75,52.5 44.38,51.87
  Top 0.3: R85.1 C42.2 C46.2 | C42.2 44.38,51.87
  Top 0.4: C42.2
DEBUG1  (via drill 0.3)
  Top 0.3: U2.54 59.75,17.5 v60,17.25
  Bottom 0.3: v60,17.25 63.25,17.25 64.5,16 64.5,14.75 | X2.P2 63.91,14.15 64.5,14.75 | R40.1 65.25,14 64.5,14.75
DEBUG2  (via drill 0.3)
  Top 0.3: U2.53 59.25,17 59.75,16.5 v60.5,16.5
  Bottom 0.3: v60.5,16.5 61.5,16.5 62.31,15.69 62.31,15.5 X2.P1
DEBUG3
  Top 0.3: U2.50 57.75,16.25 59.75,14.25 59.75,13.75 60.25,13.25 60.25,13 61.75,11.5 61.75,11.25 62.5,10.5 62.79,10.5 X2.P5
DETECT_DEMUX_N1  (via drill 0.3)
  Top 0.3: U2.20 63.25,33.25 64,34 69.5,34 v70,33.5 | v70.75,43.25 73.25,45.75 73.25,48 75,49.75 75.97,49.75 J1.5
  Bottom 0.3: v70,33.5 70,42.5 v70.75,43.25
DETECT_DEMUX_N2  (via drill 0.3)
  Top 0.3: U2.16 70,28.75 70.75,29.5 v70.75,30.75 | v70.75,41.5 70.75,42 74,45.25 74,46.5 74.75,47.25 75.94,47.25 J1.6
  Bottom 0.3: v70.75,30.75 v70.75,41.5
DETECT_DEMUX_N3  (via drill 0.3)
  Top 0.3: v73.75,28 73.75,27 73,26.25 U2.11
  Bottom 0.3: J1.7 74.39,44.65 73.5,43.75 73.5,28.25 v73.75,28
DETECT_DEMUX_N4  (via drill 0.3)
  Top 0.3: U2.10 74,25.75 v74.5,26.25
  Bottom 0.3: v74.5,26.25 74.5,35.25 74,35.75 74,41.25 75,42.25 75.86,42.25 J1.8
DETECT_DEMUX_P1
  Top 0.3: U2.35 52.25,27.75 50.75,29.25 40.75,29.25 38.5,31.5 13.5,31.5 9.25,35.75 9.25,46.75 6.25,49.75 4.02,49.75 J3.7
DETECT_DEMUX_P2
  Top 0.3: U2.36 52,27.25 50.5,28.75 40.5,28.75 38.25,31 13,31 8.5,35.5 8.5,45 6.25,47.25 4.06,47.25 J3.8
DETECT_DEMUX_P3
  Top 0.3: U2.37 51.75,26.75 50.25,28.25 40.25,28.25 38,30.5 12.75,30.5 7.75,35.5 7.75,43.25 6.25,44.75 4.1,44.75 J3.9
DETECT_DEMUX_P4
  Top 0.3: U2.38 51.5,26.25 50,27.75 40,27.75 37.75,30 12,30 7,35 7,41.5 6.25,42.25 4.14,42.25 J3.10
GND  (via drill 0.3)
  Top 0.25: ADC1.6 38.75,48.12 38.62,48.25 37.75,48.25 37.62,48.12 v37.62,47.88
  Top 0.3: 72.5,27.5 72.5,27 71.5,27 71.25,26.75 U2.12 65.05,26.75 v64,25.7 | U2.60 62.75,20.75 64,22 | 64,22 v64,23.7 | U2.63 64.25,21.75 64,22 | U2.18 64.25,31.75 64,32 64,33 64.38,33.38 65.88,33.38 66.5,32.75 | C24.2 71.6,66.6 71.5,66.5 | COMP3.4 25.52,40.98 v25.75,40.75 | R2COMP2_ADJ1.1 50.85,36.5 v50.8,36.45 | R2COMP2_ADJ1.1 53,36.88 C36.2 | R2COMP2_ADJ1.1 54.4,36.5 R30.1 | COMP1.4 64.97,40.98 65,41 65.25,41 65.5,40.75 67.25,40.75 | U2.47 51.75,21.75 50.75,20.75 50.75,20.25 v51.5,19.5 | U2.31 57.75,29.25 57.5,29.25
  Top 0.4: R27.1 28.9,36 R2COMP1_ADJ.1
  Top 0.6: C9.2 8.85,109.65 9.5,109 OK9.5 | C4.2 9.15,94.15 10,95 OK4.5 | C6.2 8.15,81.5 8.5,81.5 9,81 OK6.5 | OK7.5 9.5,67 8.5,68 8.5,70.85 C7.2 | C21.2 70.85,109.35 70.5,109 OK21.5 | C22.2 71.15,94.35 70.5,95 OK22.5 | C23.2 71.15,80.35 70.5,81 OK23.5 | OK24.5 71,67 71.5,66.5 | C28.2 36,43.35 v36,43 36,38.75 v38.75,36 | v37.62,47.88 38.5,47.88 | J3.6 6.77,52.27 v13.5,59 | C47.2 17.75,22.25 v17.5,22.5
  Bottom 0.6: OK7.5 12,67 13.5,68.5 | 13.5,68.5 13.5,80.5 | 13.5,80.5 13.5,94.5 | 13.5,94.5 13.5,100.5 | OK9.5 12.5,109 13.5,108 13.5,100.5 | OK4.5 13,95 13.5,94.5 | OK6.5 13,81 13.5,80.5 | 66.5,80.5 66.5,68.5 68,67 OK24.5 74.5,67 78.5,63 78.5,53 77.5,52 76.27,52 J1.4 | 66.5,80.5 66.5,94.5 | 66.5,94.5 66.5,100.5 | 66.5,100.5 66.5,107.5 68,109 OK21.5 | OK22.5 67,95 66.5,94.5 | OK23.5 67,81 66.5,80.5 | 13.5,100.5 14.5,99.5 65.5,99.5 66.5,100.5 | v37.62,47.88 37.12,47.38 37.12,46 | 37.12,46 37.12,44.12 v36,43 | v13.5,59 13.5,68.5 | v38.75,36 37.5,36 37.25,35.75 | R38.1 36.88,45.75 37.12,46
  other vias: 16,25.5 16,24.5 16,23.5 16,22.5 16,21.5 17.5,23.5 17,24.5 17,25.5 2.5,26 1,26 1,27.5 1,29 2.5,27.5 6.5,29.5 20.5,14 20.5,13 23,13 23,14 24,14 24,13 25,13.5 25,15 20,15 22.5,15 20,16.5 22.5,16.5 25,16.5 28.5,19 25,19 22.5,19 20.5,19 35,18 37.5,18 39.5,18 42.5,16.5 41.5,18 43.5,18 44.5,16.5 45.5,18 46.5,19 44.5,19 51.5,18 50.5,17 55.5,19 55,18 58.5,4.5 58.5,3 74,24 74,22.5 75.5,24 69.6,20.3 54.5,33 53,33 54.5,32 27.25,40.75 20.75,34.5 19,34.5 33.75,23 32.5,24.5 31.25,29 37.6,26.7 41.5,30.5 57,25.75 58.75,25.75 60.5,25.75 64,21.75 59.25,21.2 67.25,41.2 67.25,39.95 69,39.95 69,41.2 69,42.45 70.5,44.45 24,23.25 24,22.25 22.5,21.25 25,21.25 26.75,21.25 29.5,35.5 32.25,35.5 20.75,27 24.5,27 6.5,30.75 74.25,18.5 66.25,16
  pour Top (isolate 0.4): 19.5,13.5 20.5,12.5 24.5,12.5 25.5,13.5 25.5,17 27,18.5 34,18.5 36.5,16 49.5,16 56.75,8.75 56.75,0 80,0 80,20.5 21.5,20.5 19.5,18.5
  pour Bottom (isolate 0.4, rank 2): 24.5,12.5 16.5,12.5 15.5,13.5 15.5,26 17.5,28 17.5,40 18.5,41 28.5,41 33,36.5 50,36.5 52.5,39 62.25,39 70,46.75 70,54 71.5,55.5 80,55.5 80,0 58,0 58,10 55.75,12.25 46.25,12.25 43,16 36.5,16 34.5,18 26.5,18 25.5,17 25.5,13.5
  pour Bottom (isolate 0.4): 0,25.5 3,25.5 10,32.5 10,54.5 9,55.5 0,55.5
  pour Top (isolate 0.4): 0,25.5 10.5,25.5 10.5,54.5 9.5,55.5 0,55.5
  pour Top (isolate 0.4, rank 2): 15.5,20 18,22.5 19.5,22 19.5,25 20.25,25.75 21.75,25.75 21.75,20.5 80,20.5 80,55.5 71.5,55.5 70,54 70,46.75 62.25,39 52.5,39 50,36.5 33,36.5 28.5,41 14.25,41 14.25,34.25 10.5,30.5 10.5,25.5 13.5,25.5 15.5,23.5
GND_USB  (via drill 0.3)
  Top 0.3: USB1.5 44.6,9.1 44.5,9.2 44.5,10.75 43.75,11.5 IC1.2
  Top 0.7: DC-DC_9V.2 29.46,3.96 30.5,5 34.85,5 C44.2 | 29.5,3 29.5,13.96 DC-DC_3V3.2 29.5,14.04 29.5,15 30.5,16 33,16 34,15 34,12 34.65,11.35 C52.2
  other vias: 44.12,9.38 44.85,9.38 45.4,8.75 45.4,8 45.62,6 44.12,5.38 43.12,5.38 42.12,5.38 51.5,0.75 49.5,1 51.5,1.5 41,1 43,1 41.35,10.35
  pour Bottom (isolate 0.3, no thermals): 28.5,0 56,0 56,7 54.5,8.5 46,8.5 40.25,14.25 35.25,14.25 33,16.5 29.5,16.5 28.5,15.5
  pour Top (isolate 0.4, rank 2, no thermals): 28.5,0 52,0 52,11 48.75,14.25 35.25,14.25 33,16.5 29.5,16.5 28.5,15.5
I2C1_SCL  (via drill 0.3)
  Top 0.3: J3.11 4.93,39.57 6,38.5 v6,34.75 6,34 6,33.75 10.25,29.5 28.75,29.5 30.5,27.75 30.5,25.75 31,25.25 v31,23 | v61.5,22.25 61.75,22 U2.58
  Bottom 0.3: v31,23 31.5,23 33,21.5 41.25,21.5 42.5,22.75 61,22.75 v61.5,22.25 | R34.2 5.75,35 v6,34.75
I2C1_SDA  (via drill 0.3)
  Top 0.3: U2.59 62.25,22 v62.5,22.25 | v30.25,24.75 30,25 30,27.5 28.5,29 9.5,29 5.38,33.12 v5.12,33.38 4,34.5 J3.12
  Bottom 0.3: v62.5,22.25 62.5,22.5 61.75,23.25 42.25,23.25 41,22 33.25,22 30.5,24.75 v30.25,24.75 | R35.2 5,33.5 v5.12,33.38
I2C2_SCL  (via drill 0.3)
  Top 0.3: U2.29 58.75,32.75 v58.5,33 | v62.25,34.5 72,34.5 73,35.5 | J1.9 76.06,39.5 74.75,39.5 73,37.75 73,35.5 | R32.2 77.1,22.9 v76.75,23.25 | v75.75,35.25 73.25,35.25 73,35.5
  Bottom 0.3: v58.5,33 60,34.5 v62.25,34.5 | v76.75,23.25 76.75,34.25 v75.75,35.25
I2C2_SDA  (via drill 0.3)
  Top 0.3: U2.62 63.75,18 64.5,17.25 75,17.25 v76.75,19 77.1,19.35 R33.2
  Bottom 0.3: v76.75,19 77.75,20 77.75,35.27 J1.10
I2C3_SCL  (via drill 0.3)
  Top 0.3: J3.1 2.72,64.97 1.25,63.5 1.25,32.25 4.38,29.12 | 4.38,29.12 5.5,28 27.75,28 29,26.75 29,22.5 v29.5,22 | v57.5,21.5 57.5,23.75 56.5,24.75 U2.41 | v4.25,29 4.38,29.12
  Bottom 0.3: v29.5,22 31,20.5 41.75,20.5 43,21.75 57.25,21.75 v57.5,21.5 | R36.2 4.1,29.15 v4.25,29
I2C3_SDA  (via drill 0.3)
  Top 0.3: J3.2 2.68,62.43 2,61.75 2,32.5 5.25,29.25 | 5.25,29.25 6,28.5 28,28.5 29.5,27 29.5,23.25 v31,21.75 | U2.56 60.75,21 v61,21.25 | v5.25,29.75 5.25,29.25
  Bottom 0.3: v61,21.25 61,21.5 60.25,22.25 42.75,22.25 41.5,21 31.75,21 v31,21.75 | R37.2 4.5,32 5.25,31.25 v5.25,29.75
I_MESS
  Top 0.4: OP1.3 29.07,50.08 29.75,50.75 29.75,55.4 D1.3
  Top 0.6: SJ7.2 29,57.75 30,56.75 30,55.65 D1.3
LED1
  Top 0.3: U2.61 63.25,17.5 65.5,15.25 65.5,11 67,9.5 R79.1 67.1,7.5
LED2
  Top 0.3: U2.57 61.25,18.5 64.75,15 64.75,10.5 65.25,10 R31.1 65,7.6
MCLK2_OUT  (via drill 0.3)
  Top 0.3: U2.40 34.25,25.25 v34.1,25.1
  Bottom 0.3: v34.1,25.1 34.25,25.25 34.25,26.98 SJ2.1
N$1
  Top 0.6: OK4.1 21.69,92.46 R11.1
N$2
  Top 0.3: R2COMP2.2 R2COMP2_ADJ.2
N$3
  Top 0.3: LED4.A 65.5,5.4 R31.2
N$4
  Top 0.3: U2.30 58.25,32.12 C29.1
N$5
  Top 0.4: R86.1 R23.1
N$6
  Top 0.3: RED18.C 60.5,36 63.9,36 R29.2
N$7
  Top 0.3: 57.75,36.25 G18.C R30.2
N$8
  Top 0.3: COMP1.2 60.83,39.67 62,38.5 63.9,38.5 R1COMP3.2 65.55,38.15 R2COMP3.1
N$9
  Top 0.3: COMP1.5 54.38,40.98 R1COMP4.2 R2COMP4.1
N$10
  Top 0.3: G17.C 18.1,36 R87.2
N$11
  Top 0.4: OP1.5 24.25,50.77 R9.1 24.15,52.5 R10.1
N$12
  Top 0.3: R2COMP3.2 68.65,38.25 R2COMP1_ADJ1.2
N$13
  Top 0.3: R2COMP4.2 52.75,38.65 R2COMP2_ADJ1.2
N$14
  Top 0.6: OK6.1 21.69,78.46 R13.1
N$15  (via drill 0.3)
  Top 0.2: S1.2 67.85,11.1 R39.2 67.15,11.1 | 67.15,11.1 67,11.25 | 67.15,11.1 66.65,11.1 v66.5,11.25
  Top 0.3: 67.12,11.38 C68.1 67.12,14.18 R14.1 | 67.12,11.38 67.25,11.25 | 67.25,11.25 67.5,11.25 | 67.5,11.25 S1.2 | 67.12,11.38 67.5,11.38 67.5,11.25 | R39.2 67.4,11.1 67.25,11.25 | 67.12,11.38 67,11.25 v66.5,11.25
  Bottom 0.3: R40.2 65.35,11.25 v66.5,11.25 67,11.25 67.15,11.1 R39.2
N$16
  Top 0.6: OK7.1 21.69,64.46 R17.1
N$17
  Top 0.6: OK9.1 21.69,106.46 R25.1
N$24
  Top 0.4: R8.1 26.25,47.4 26.25,49.25 25.43,50.08 OP1.6 23.18,50.08 22.25,51 22.35,51 R7.2
N$27
  Top 0.4: R4.2 18.75,53.65 18.75,53.25 18.32,52.83 OP2.6 18.32,51.17 18.75,50.75 20.4,50.75 R5.1
N$28  (via drill 0.3)
  Top 0.3: COMP3.3 COMP3.6 21.82,40.33 22,40.5 22,41.5 21.5,42 16.75,42 16.25,42.5 v16.25,44.25 | v17.5,46 17.5,47.77 OP2.2
  Top 0.4: OP2.2 OP2.1
  Bottom 0.3: v17.5,46 17.5,45.5 v16.25,44.25
N$30
  Top 0.6: OK21.1 58.31,111.54 R46.1
N$31
  Top 0.3: 26.4,39.5 R1COMP1.2 | COMP3.2 26.18,39.67 R1COMP1.2 | R2COMP1.1 28.4,39.1 27.75,39.75 26.65,39.75 R1COMP1.2
N$32
  Top 0.6: JP2.2 46.78,72.93 45,71.15 STIM_LOAD_OUT_N.1 45,68 CH_A_WEISS.1
N$34
  Top 0.6: OK22.1 58.31,97.54 R49.1
N$35
  Top 0.6: OK23.1 58.31,83.54 R51.1
N$36
  Top 0.6: OK24.1 58.31,69.54 R53.1
N$51
  Top 0.6: R2V.1 R2V_ADJ.1
N$52
  Top 0.4: OP3.5 55.8,47.65 R107.1 R108.1
N$54
  Top 0.6: JP1.2 33.32,72.93 35,71.25 STIM_LOAD_OUT_P.1 35,68 CH_A_BRAUN.1
N$55
  Top 0.6: X1.2 X1.1 JP3.2
N$56
  Top 0.6: R1.1 JP9.2
N$57
  Top 0.6: JP4.2 X1.4 X1.3
N$58
  Top 0.6: R1.2 JP10.2
N$59
  Top 0.6: JP7.2 R2.2
N$60
  Top 0.4: R106.1 53.75,52.6 53.75,51 54.83,49.92 OP3.6 56.83,49.92 57.25,49.5 57.65,49.5 R105.2
N$61
  Top 0.3: IC1.6 46.95,12.45 R48.1
N$62
  Top 0.6: C17.1 43.9,105 44.78,105 JP8.2 44.78,101 R19.2
N$63
  Top 0.6: C19.2 42.55,92.53 | R21.2 42.55,92.87 42.55,92.53 | 42.55,92.53 R22.1
N$64
  Top 0.6: JP6.2 46.78,92.5 | 46.78,92.5 46.78,88.83 C19.1 | R22.2 46.28,92 46.78,92.5
N$65
  Top 0.6: JP5.2 33.32,92 | 33.32,92 33.32,88.73 C18.2 | R20.1 33.32,92
N$66
  Top 0.6: R21.1 38.58,94.08 37.5,93 37.5,92 | 37.5,92 37.5,88.55 C18.1 | R20.2 37.5,92
N$68
  Top 0.4: R103.1 61.85,49.4 62.17,49.08 OP4.6 62.17,47.17 61.75,46.75 61.75,46.35 R102.2
N$70
  Top 0.6: R2.1 38.65,103 38.65,102.98 | C17.2 40.5,105.5 39,104 39,103.08 R2.1 | 40.5,100.5 R19.1 40,101 39,102 39,102.92 R2.1
N$71
  Bottom 0.3: ISO_1.3 ISO_1.4 51.62,4.96 50.38,4.96 ISO_1.5
  Bottom 0.4: 51.62,4.96 51.62,3.12 C40.1
N$73  (via drill 0.3)
  Top 0.3: R48.2 49.5,12.25 50,11.75 50,4.25 v49.25,3.5
  Bottom 0.3: v49.25,3.5 49.25,4.82 ISO_1.6
N$74  (via drill 0.3)
  Top 0.3: R80.2 48.85,10.65 49.25,10.25 49.25,5.75 48.5,5 47.5,5 v45.5,3
  Bottom 0.3: ISO_1.7 47.83,3.58 47.25,3 v45.5,3
N$75
  Top 0.3: 47.1,7.6 USB1.7 48.1,7.9 R81.2
N$78
  Top 0.6: R15.1 11.5,15.75 11,15.25 LED2.C
N$86
  Top 0.3: R83.2 19.15,24.9 LED3.A
N$92
  Top 0.25: ADC1.11 39.75,45 39,44.25 C27.1
N$93
  Top 0.25: ADC1.13 40.75,43.88 C26.1
N$95
  Top 0.4: OP4.3 62.17,54.08 R84.2 R86.2
N$97
  Top 0.3: RED17.C R27.2
N$98
  Top 0.3: U2.5 71.29,23.25 OSC1.3
N$99
  Top 0.3: COMP3.5 18.88,40.98 R1COMP2.2 R2COMP2.1
N$103
  Top 0.3: LED6.A R79.2
N$104
  Top 0.3: R2COMP1.2 30.1,37.9 31.25,36.75 31.25,36.1 R2COMP1_ADJ.2
N$107
  Top 0.6: LED1.A 2.75,12.85 R111.2
N$114
  Top 0.3: USB1.3 43,10.2 IC1.3
N$115
  Top 0.3: USB1.2 42.2,11.7 43,12.5 43.4,12.5 IC1.1
N$116
  Top 0.3: IC1.4 46.95,10.55 R80.1
NPULSE_DETECT_I
  Top 0.3: COMP3.7 22.32,39.67 22.75,39.25 22.75,38 | 22.75,38 22.75,37.75 G17.A | U2.28 59.25,33.5 58.5,34.25 52,34.25 51.75,34 24.5,34 23.5,35 23.5,37.25 22.75,38
NPULSE_DETECT_V  (via drill 0.3)
  Top 0.3: COMP1.7 57.08,39.67 v58,38.75 G18.A | v64.75,32.65 U2.17
  Bottom 0.3: v58,38.75 62.75,38.75 64.75,36.75 v64.75,32.65
PPULSE_DETECT_I
  Top 0.3: COMP3.1 24.73,39.02 25.25,38.5 RED17.A 24.5,37.5 24.25,37.25 24.25,35.25 25,34.5 51.25,34.5 51.5,34.75 58.75,34.75 59.75,33.75 U2.27
PPULSE_DETECT_V  (via drill 0.3)
  Top 0.3: COMP1.1 60.25,38.83 RED18.A 61,37.75 61.75,37 66.75,37 v67.25,36.5 | v68,28 67.75,27.75 U2.14
  Bottom 0.3: v67.25,36.5 67.25,28.75 v68,28
RESET  (via drill 0.3)
  Top 0.3: U2.7 68,24.25 v68.25,24
  Bottom 0.3: X3.P5 65.34,6.59 67.5,8.75 R39.1 67.9,9.4 68.75,10.25 68.75,13.25 68.25,13.75 v68.25,24
SC_N1  (via drill 0.3)
  Top 0.3: 74,109 77.5,105.5 77.5,93.5 75.75,91.75 75.75,63.25 v75,62.5 | U2.2 69.75,21.75 v70,22
  Top 0.6: OK21.4 69.96,106.46 71,107.5 71.85,107.5 C21.1 73.15,107.65 74,108.5 74,109 R47.2
  Bottom 0.3: v75,62.5 73,60.5 73,23 72,22 v70,22
SC_N2  (via drill 0.3)
  Top 0.3: OK22.4 74.04,92.46 74.75,91.75 74.75,63.75 v74,63 | v69.25,22.5 69,22.25 U2.3
  Top 0.6: OK22.4 68.85,92.5 71.85,92.5 C22.1 72.15,92.5 73,92.5 74,93.5 R50.2
  Bottom 0.3: v74,63 72.5,61.5 72.5,23.5 71.75,22.75 69.5,22.75 v69.25,22.5
SC_N3  (via drill 0.3)
  Top 0.3: OK23.4 72.54,78.46 73.75,77.25 73.75,64.25 v73,63.5 | v69.5,24 68.75,24.75 U2.8
  Top 0.6: OK23.4 68.85,78.5 72,78.5 C23.1 72.15,78.5 72.5,78.5 73.5,79.5 73.5,81.5 72.85,82.15 R52.2
  Bottom 0.3: v73,63.5 72,62.5 72,24.75 71.25,24 v69.5,24
SC_N4  (via drill 0.3)
  Top 0.3: v71,61.5 70.75,61.75 70.75,62.6 R54.2 | U2.9 69.5,25.25 v70,24.75
  Top 0.6: C24.1 71.65,64.9 71.25,64.5 | 71.25,64.5 68.85,64.5 OK24.4 | R54.2 70.6,63.85 71.25,64.5
  Bottom 0.3: v71,61.5 71.5,61 71.5,25.25 71,24.75 v70,24.75
SC_P1  (via drill 0.3)
  Top 0.3: R26.2 6,110 5,110 2,107 2,95.5 4,93.5 4,77.75 5.5,76.25 v5.5,67.5 | U2.33 54,28.75 51.25,31.5 39.5,31.5 39,32 14,32 10.25,35.75 10.25,52 v9.25,53
  Top 0.6: OK9.4 8.14,111.54 8,111.4 C9.1 | 8,111.1 C9.1 | R26.2 6,110.5 7,111.5 7.85,111.5 C9.1
  Bottom 0.3: v9.25,53 9.25,61 6.25,64 6.25,66.25 5.5,67 v5.5,67.5
SC_P2  (via drill 0.3)
  Top 0.3: R12.2 5.1,93.85 4.75,93.5 4.75,78.25 6.5,76.5 v6.5,67.25 | U2.23 v61.75,28.88 | v50.5,32.25 41.75,32.25 41.5,32 39.75,32 39.25,32.5 14.25,32.5 10.75,36 10.75,53.5 v10.5,53.75
  Top 0.6: OK4.4 9.89,97.54 9.89,97.39 8.5,96 8.15,96 C4.1 6.85,95.85 6,95 R12.2
  Bottom 0.3: v10.5,53.75 10.25,54 10.25,60.75 7,64 7,66.75 v6.5,67.25 | v61.75,28.88 61.12,28.25 54.5,28.25 v50.5,32.25
SC_P3  (via drill 0.3)
  Top 0.3: 6.5,82.75 6.5,77.75 7.5,76.75 v7.5,67.5 | U2.24 61.25,29.5 v60.88,29.12 | v50.75,33.25 42,33.25 41.25,32.5 40,32.5 39.5,33 14.5,33 11.25,36.25 11.25,54.5 v11,54.75
  Top 0.6: OK6.4 11.15,83.5 8.15,83.5 C6.1 7.85,83.5 7,83.5 6.5,83 6.5,82.75 6.5,80.5 7.15,79.85 R16.2
  Bottom 0.3: v11,54.75 11,60.75 7.75,64 7.75,67.25 v7.5,67.5 | v60.88,29.12 60.75,29 55,29 v50.75,33.25
SC_P4  (via drill 0.3)
  Top 0.3: U2.25 60.75,33.75 59.25,35.25 v40.75,35.25 | v40.5,33.25 40.25,33.5 14.75,33.5 11.75,36.5 11.75,54.75 v12,55
  Top 0.6: 11.15,69.5 OK7.4 10.6,70.13 C7.1 10.6,72.95 R18.2
  Bottom 0.3: OK7.4 11.15,69.5 9.5,69.5 8.5,68.5 8.5,64 11.75,60.75 11.75,55.25 v12,55 | v40.75,35.25 40.75,33.5 v40.5,33.25
SPI1_MISO  (via drill 0.3)
  Top 0.3: U2.22 62.25,29.38 62.62,29 v62.62,28.88
  Bottom 0.3: v62.62,28.88 62.62,25.38 61.25,24 41.5,24 40.25,22.75 36.25,22.75 35.75,23.25 35.75,23.98 SJ1.3
SPI1_SCK
  Top 0.3: 58.75,28.25 U2.34 53.25,28.25 51.25,30.25 R28.1 | 58.75,28.25 59.62,28.25 59.62,29.12 60.25,29.75 U2.26 | U2.21 62.75,29.88 63.5,29.12 63.5,28.62 63,28.12 58.88,28.12 58.75,28.25
SPI4_MOSI  (via drill 0.3)
  Top 0.3: U2.15 64.5,28.25 63.25,27 v60.25,27 | v47.5,27 45.75,27 R24.1
  Bottom 0.3: v60.25,27 v47.5,27
SPI5_MOSI  (via drill 0.3)
  Top 0.3: U2.43 v39.75,23.75
  Bottom 0.3: v39.75,23.75 39,23.75 38.52,24.23 SJ1.1
STIMN
  Top 0.6: JP6.1 JP8.1 JP10.1 49.32,111.5 49.82,112 R46.2 56.25,111.9 G9.C G10.C RED9.A RED10.A | JP6.1 JP4.1 | JP4.1 JP2.1 49.32,74.1 R1V.2 52.2,71.75 54.5,71.75 | R49.2 56.25,97.9 G11.C G12.C | G12.C RED11.A RED12.A | R51.2 56.25,83.9 G13.C G14.C | RED16.A RED15.A G16.C G15.C 56.25,69.9 R53.2 56.15,70.1 54.5,71.75 | G14.C RED13.A RED14.A | G12.C JP6.1 | G14.C JP4.1 | 54.5,71.75 61.75,71.75 64,69.5 64,62 66.25,59.75 75.25,59.75 75.41,59.84 75.41,59.88 J1.1
STIMN_STIMULATOR1
  Top 0.6: OK21.2 G10.A | G9.A G10.A | G10.A RED9.C RED10.C 57.75,103.25 XS5.1
STIMN_STIMULATOR2
  Top 0.6: G11.A G12.A | G12.A RED11.C RED12.C 57.75,89.25 XS6.1 | OK22.2 G12.A
STIMN_STIMULATOR3
  Top 0.6: G13.A G14.A | OK23.2 G14.A | G14.A RED13.C RED14.C 57.75,75.25 XS7.1
STIMN_STIMULATOR4
  Top 0.6: G16.A RED15.C RED16.C 57.75,61.25 XS8.1 | G15.A G16.A | OK24.2 G16.A
STIMP
  Top 0.6: G1.A OK9.2 18.25,109 17,107.75 17,94.75 | G2.A G1.A | RED4.C RED3.C G4.A | G4.A OK4.2 17.25,95 17,94.75 | G4.A G3.A | RED6.C RED5.C G6.A | G6.A G5.A | G6.A OK6.2 17.25,81 17,80.75 | RED8.C RED7.C G8.A | G7.A G8.A | G8.A OK7.2 18.25,67 | RED1.C RED2.C G1.A | 17,94.75 17,80.75 | 17,80.75 17,72 | 17,72 17,68.25 18.25,67 | 17,72 17.3,71.7 R_MESS.2 R_MESS_ADJ.1 27.08,65.92 27.5,65.5 27.5,64.02 SJ7.3 27.5,63.98 27.5,63.5 27,63 R91.1 | J3.3 9.89,59.89 17,67 18.25,67
STIMP_MODEL
  Top 0.6: JP9.1 JP7.1 JP5.1 JP3.1 JP1.1 30.78,73.78 29.92,72.92 R_MESS.1 R_MESS_ADJ.2 29.92,66.08 30.5,65.5 30.5,64.02 SJ7.1 30.5,63.98 30.5,63.5 31,63 R89.1
STIMP_STIMULATOR1
  Top 0.6: RED1.A RED2.A G1.C G2.C 23.75,106 R25.2 23.85,104.85 XS1.1
STIMP_STIMULATOR2
  Top 0.6: RED4.A RED3.A G4.C G3.C 23.75,92.1 R11.2 23.85,90.85 XS2.1
STIMP_STIMULATOR3
  Top 0.6: RED6.A RED5.A G6.C G5.C 23.75,78.1 R13.2 23.85,76.85 XS3.1
STIMP_STIMULATOR4
  Top 0.6: RED8.A RED7.A G8.C G7.C 23.75,64.1 R17.2 23.85,62.85 XS4.1
SWDIO
  Top 0.3: X3.P4 60.13,8.12 59.38,8.12 59,8.5 59,9.75 58,10.75 58,12.5 56.5,14 56.5,21.75 56,22.25 U2.46
SWOUT  (via drill 0.3)
  Top 0.3: U2.55 60.25,18.25 61.25,17.25 61.25,15.75 v61,15.5
  Bottom 0.3: X3.P6 59.96,5.5 59.5,5.5 59,6 59,12.25 61,14.25 v61,15.5
SWSCK
  Top 0.3: U2.49 57.25,14.25 58.75,12.75 58.75,11 59.25,10.5 60.04,10.5 X3.P2
TIM3_CH3  (via drill 0.3)
  Top 0.3: U2.39 32.25,25.75 v32,26
  Bottom 0.3: v32,26 32,26.25 31.5,26.75 31.5,27.23 SJ2.3
USART3_RX
  Top 0.3: U2.52 58.75,16.75 62,13.5 62.77,12.75 X2.P3
USART3_TX
  Top 0.3: U2.51 58.25,16.5 61,13.75 61,13.25 62.5,11.75 62.75,11.75 X2.P4
USB_DM_MCU  (via drill 0.3)
  Top 0.3: U2.44 49.75,23.25 49,22.5 v49,18.5
  Bottom 0.3: v49,18.5 49,15.12 ISO_1.11
USB_DP_MCU  (via drill 0.3)
  Top 0.3: U2.45 50.25,22.75 49.75,22.25 v49.75,19.75
  Bottom 0.3: 48,15.2 ISO_1.10 47.75,15.1 47.75,18.5 48.5,19.25 49.5,19.25 49.75,19.5 v49.75,19.75
V_STIM
  Top 0.4: OP3.3 50.83,49.92 50.5,50.25 50.5,55.35 D2.3
  Top 0.6: D2.3 51,56.25 50.75,56.5 50.75,57.5 51.9,58.65 51.9,68.95 R1V.1 51.84,68.42 R2V.2
VA_1
  Top 0.3: OP2.3 18.32,46.42 19.25,45.5 28.75,45.5 31.5,48.25 31.5,49.75 R6.1
  Top 0.4: OP1.7 23.18,49.42 22.75,49 22.35,49 R7.1 R5.2 20.6,49.15 20.25,49.5 18.75,49.5 18.32,49.08 OP2.3
VA_2  (via drill 0.3)
  Top 0.3: R104.1 49,49.25 49,47.75 52.5,44.25 59.25,44.25 59.75,44.75 | 59.75,44.75 59.75,47.75 58.88,48.62 58.88,50.6 58.38,51.1 | COMP1.6 58.75,40.33 | 58.75,40.33 COMP1.3 58.92,40.33 | 59.75,44.75 60.25,44.5 v61.25,44.5 | 58.75,40.33 58.75,42 59.5,42.75 62,42.75 v62.75,43.5
  Top 0.4: OP3.7 56.83,50.58 57.25,51 57.65,51 R105.1 58.38,51.1 R103.2
  Bottom 0.4: v62.75,43.5 62.25,43.5 v61.25,44.5
VB_1
  Top 0.3: OP2.7 17.68,50.92 15.5,48.75 15.5,46.75 17.5,44.75 29,44.75 R3.2
  Top 0.4: OP2.7 17.68,52.83 17.25,53.25 17.25,53.65 R4.1
VB_2
  Top 0.3: 62.83,47.17 63.38,46.62 63.5,45.75 61.25,43.5 52.25,43.5 R85.2 46.98,48.9
  Top 0.4: OP4.7 62.83,47.17 63.25,46.75 63.25,46.35 R102.1
VREF  (via drill 0.3)
  Top 0.25: ADC1.14 41.25,45.75 43,44 C61.1
  Top 0.4: v45.25,41 45.25,41.45 U1.6 44.69,41.81 44.25,42.25 44.25,43 43.75,43.5 43.12,43.5 C61.1 | R84.1 62.1,55.85 v61.5,55.25
  Bottom 0.4: v45.25,41 47.25,43 57,43 62,48 62,54.75 v61.5,55.25
VREF/2  (via drill 0.3)
  Top 0.4: OP4.2 OP4.1 65.21,52.05 C60.1 67.48,52.23 TP14.TP | R108.2 58.1,45.9 v58.62,46.38 | OP4.5 60.92,47.95 v60.75,48.12 | v20.38,53.62 20.38,52.77 R10.2 20.52,52.38 19.25,52.38 18.98,52.1 OP2.5
  Bottom 0.4: v58.62,46.38 58.5,46.5 58.5,49 | 58.5,49 58.5,52.5 57.5,53.5 | v60.75,48.12 60.75,48 59.5,48 58.5,49 | 57.5,53.5 49,53.5 48.75,53.75 29,53.75 28,52.75 21.25,52.75 v20.38,53.62 | TP14.TP 67.25,52.25 67.5,52.5 67.5,55 65.5,57 60.5,57 57.5,54 | 57,53.5 57.5,54 | 57.5,54 57.5,53.5

## Text on the board
tPlace: 1k OHM | + | - | - | SKIN | + | MODEL | CH1+ | CH1- | + | Prüfmodel | - | - | + | CH2+ | CH2- | + | - | - | + | EXTERN | CH3+ | CH3- | + | CH A | - | - | + | Rm+Rl | nur Rl | CH4+ | CH4- | <STIM+ | Rm+Rl | nur Rl | STIM- > | Demux Extention + | Demux Extention - | ^ | ^ | ^ | | | Pulse+ | ^ | Pulse- | | | Pulse- | Pulse+ | TU Berlin | +5V | Stimulation / Testbed | Valtin / Rev 01 - 30.07.2018 / ID: RS2086 | Reset/Button | +9V | GND | +5V | -9V | DEBUG | Programmer | Status> | ^Error
bPlace: TU Berlin | Stimulation / Testbed | Valtin / Rev 01 - 30.07.2018 / ID: RS2086 | MCLK | TIM | MOSI | MISO | GND | +5V | Button | Reset